# Altium schematic sheet edge_dff_drafts.SchDoc
size A4
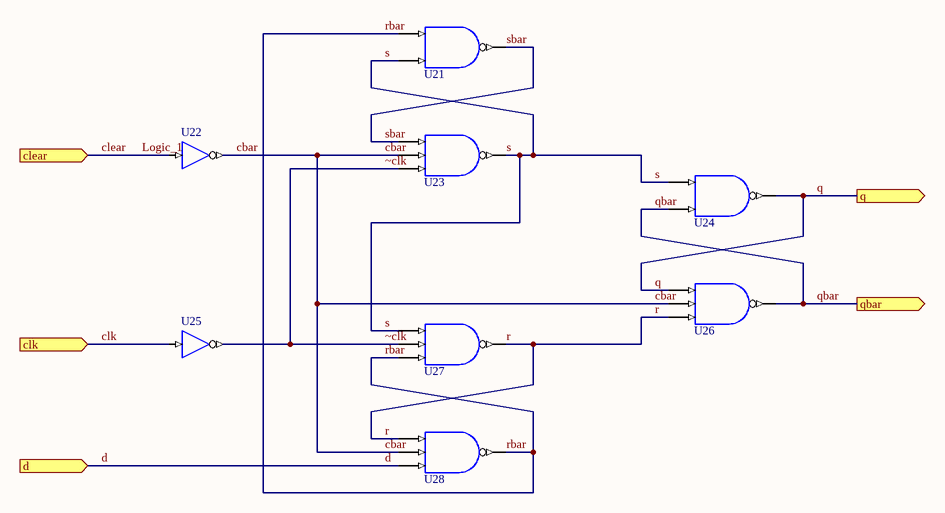
[diagram p0: edge_dff_drafts.SchDoc]

## Parts
U21  AND 2  (value not drawn)
U22  BUF_inv  (value not drawn)
U23  NAND_3  (value not drawn)
U24  AND 2  (value not drawn)
U25  BUF_inv  (value not drawn)
U26  NAND_3  (value not drawn)
U27  NAND_3  (value not drawn)
U28  NAND_3  (value not drawn)

## Ports
clear (in), clk (in), d (in), q (out), qbar (out)

## Nets
cbar: U22.O U23.B U26.B U28.B
clear: U22.I ; port clear  [also labelled Logic_1]
clk: U25.I ; port clk
d: U28.C ; port d
q: U24.Y U26.A ; port q
qbar: U24.B U26.Y ; port qbar
r: U26.C U27.Y U28.A
rbar: U21.A U27.C U28.Y
s: U21.B U23.Y U24.A U27.A
sbar: U21.Y U23.A
~clk: U23.C U25.O U27.B

## Library data of the parts
U21 U24 = AND_2: 2 Input AND
U22 U25 = BUF_inv: 1-bit General Purpose (Non-inverting) Buffer
U23 U26-U28 = NAND_3: 3 Input NAND 1 Not